# Altium project Phaser.PrjPCB (part 2 of 9)

## Sheet PWR_Supply.SchDoc: Phaser
size 420 x 297 mm; EDA_Number: ARTIQ; Projet: ARTIQ/SINARA; Author: G.Kasprowicz; CompanyName: WUT ISE; DrawnBy: G.Kasprowicz; Organization: WUT ISE; Address1: PW ISE; Address2: Nowowiejska 15/19 00-665 Warsaw; Address3: gkasprow@gmail.com; DocumentNumber: 16; Revision: 2; SheetNumber: 16; SheetTotal: 18; ModifiedBy: -; CheckedDate: -; Title2: AFE PWR, testpoints, LEDs; DivGrp: WUT ISE; Designer: G.Kasprowicz; ModifiedDate: -; ProjectName: Sensor Box
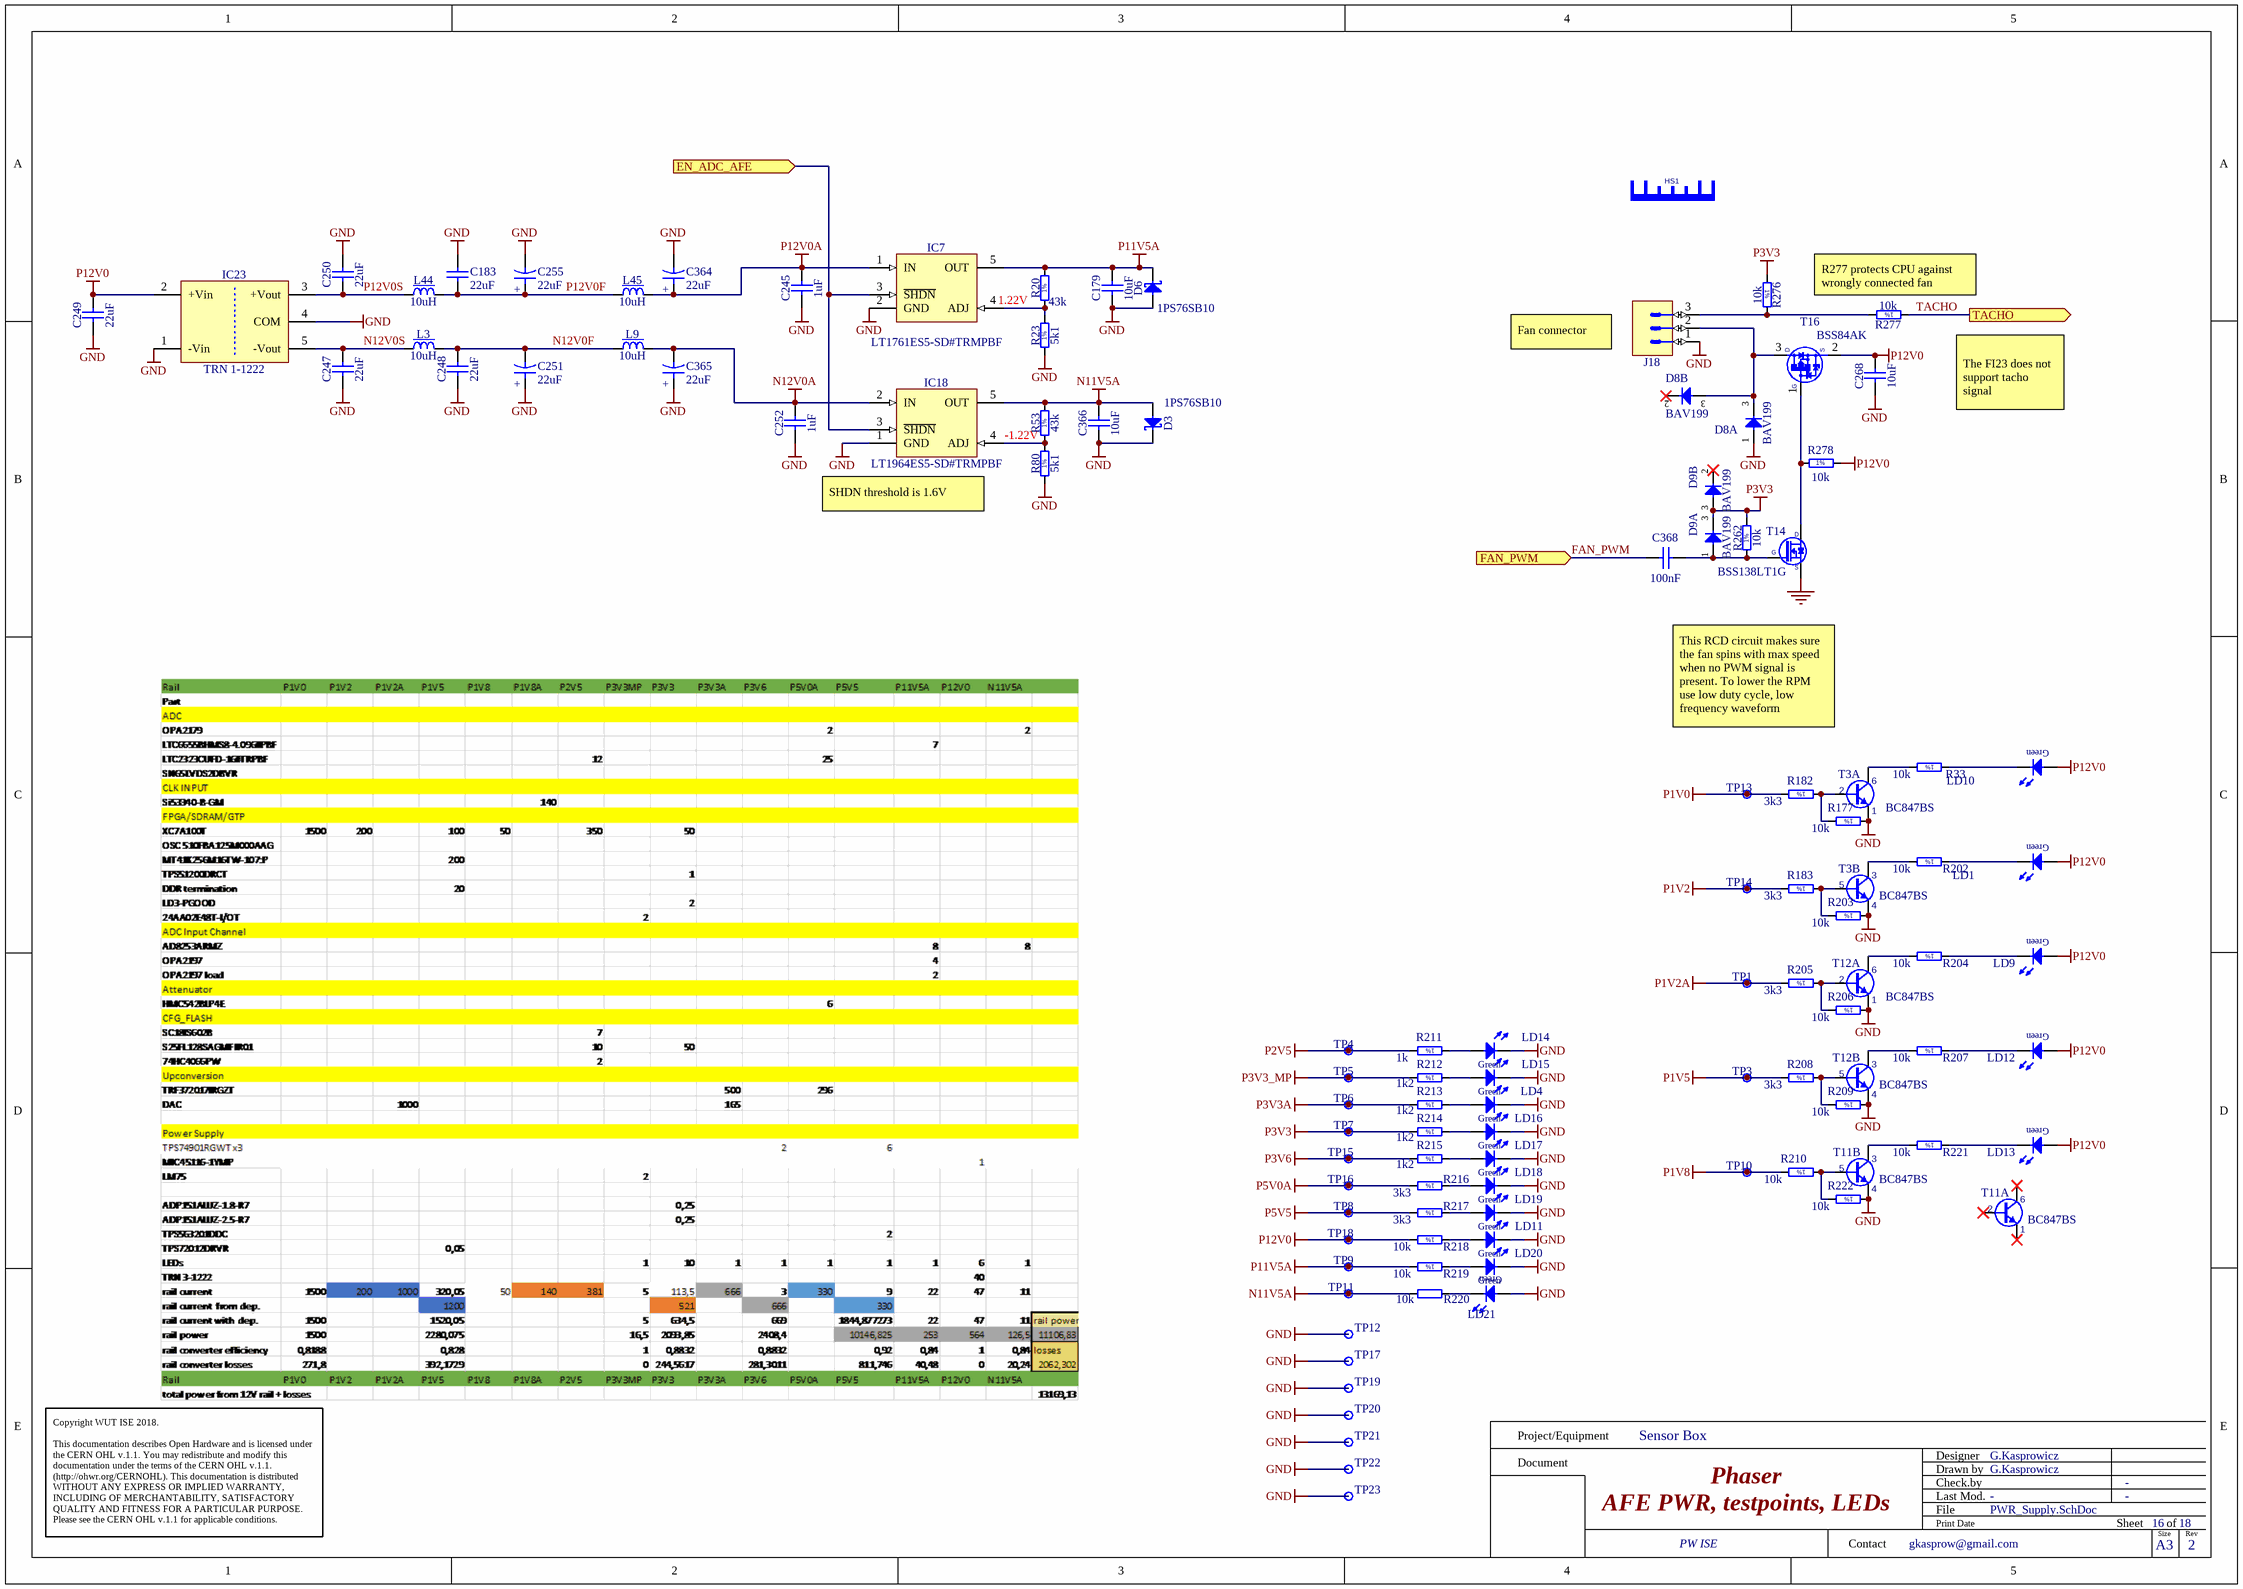
[diagram p3: PWR_Supply.SchDoc]

### Parts
C179  10uF  [CAPC2012X135N]
C183  22uF  [CAPC2012X135N]
C245  1uF  [CAPC1608X87N]
C247  22uF  [CAPC2012X135N]
C248  22uF  [CAPC2012X135N]
C249  22uF  [CAPC2012X135N]
C250  22uF  [CAPC2012X135N]
C251  22uF  [CAPMP3528X210N]
C252  1uF  [CAPC1608X87N]
C255  22uF  [CAPMP3528X210N]
C268  10uF  [CAPC2012X135N]
C364  22uF  [CAPMP3528X210N]
C365  22uF  [CAPMP3528X210N]
C366  10uF  [CAPC2012X135N]
C368  100nF  [CAPC0603X33N]
D3  1PS76SB10  [SOD2512X110N]
D6  1PS76SB10  [SOD2512X110N]
D8  BAV199  [SOT95P240X110-3N]  (parts A,B of 2)
D9  BAV199  [SOT95P240X110-3N]  (parts A,B of 2)
HS1  RADIAN_FI23  [RADIAN_FI23]  (value not drawn)
IC7  LT1761ES5-SD#TRMPBF  [SOT95P280X100-5N]
IC18  LT1964ES5-SD#TRMPBF  [SOT95P280X100-5N]
IC23  TRN 1-1222  [DCDC_TRACO_TRN1]
J18  KK®  [MOLEX_22-27-2031]  (value not drawn)
L3  10uH  [IND_MURATA-PS_8400]
L9  10uH  [IND_MURATA-PS_8400]
L44  10uH  [IND_MURATA-PS_8400]
L45  10uH  [IND_MURATA-PS_8400]
LD1  Green  [LED_KINGBRIGHT_KPH-1608CGCKr]  (value not drawn)
LD4  Green  [LED_KINGBRIGHT_KPH-1608CGCKr]  (value not drawn)
LD9  Green  [LED_KINGBRIGHT_KPH-1608CGCKr]  (value not drawn)
LD10  Green  [LED_KINGBRIGHT_KPH-1608CGCKr]  (value not drawn)
LD11  Green  [LED_KINGBRIGHT_KPH-1608CGCKr]  (value not drawn)
LD12  Green  [LED_KINGBRIGHT_KPH-1608CGCKr]  (value not drawn)
LD13  Green  [LED_KINGBRIGHT_KPH-1608CGCKr]  (value not drawn)
LD14  Green  [LED_KINGBRIGHT_KPH-1608CGCKr]  (value not drawn)
LD15  Green  [LED_KINGBRIGHT_KPH-1608CGCKr]  (value not drawn)
LD16  Green  [LED_KINGBRIGHT_KPH-1608CGCKr]  (value not drawn)
LD17  Green  [LED_KINGBRIGHT_KPH-1608CGCKr]  (value not drawn)
LD18  Green  [LED_KINGBRIGHT_KPH-1608CGCKr]  (value not drawn)
LD19  Green  [LED_KINGBRIGHT_KPH-1608CGCKr]  (value not drawn)
LD20  Green  [LED_KINGBRIGHT_KPH-1608CGCKr]  (value not drawn)
LD21  Green  [LED_KINGBRIGHT_KPH-1608CGCKr]  (value not drawn)
R20  43k  [RESC1005X40N]
R23  5k1  [RESC1005X40N]
R33  10k  [RESC1005X40N]
R53  43k  [RESC1005X40N]
R80  5k1  [RESC1005X40N]
R177  10k  [RESC1005X40N]
R182  3k3  [RESC1608X55N]
R183  3k3  [RESC1608X55N]
R202  10k  [RESC1005X40N]
R203  10k  [RESC1005X40N]
R204  10k  [RESC1005X40N]
R205  3k3  [RESC1608X55N]
R206  10k  [RESC1005X40N]
R207  10k  [RESC1005X40N]
R208  3k3  [RESC1608X55N]
R209  10k  [RESC1005X40N]
R210  10k  [RESC1005X40N]
R211  1k  [RESC1608X55N]
R212  1k2  [RESC1608X55N]
R213  1k2  [RESC1608X55N]
R214  1k2  [RESC1608X55N]
R215  1k2  [RESC1608X55N]
R216  3k3  [RESC1608X55N]
R217  3k3  [RESC1608X55N]
R218  10k  [RESC1005X40N]
R219  10k  [RESC1005X40N]
R220  10k  [RESC1608X55N]
R221  10k  [RESC1005X40N]
R222  10k  [RESC1005X40N]
R262  10k  [RESC1005X40N]
R276  10k  [RESC1005X40N]
R277  10k  [RESC1005X40N]
R278  10k  [RESC1005X40N]
T3  BC847BS  [SOT65P210X110-6N]  (parts A,B of 2)
T11  BC847BS  [SOT65P210X110-6N]  (parts A,B of 2)
T12  BC847BS  [SOT65P210X110-6N]  (parts A,B of 2)
T14  BSS138LT1G  [SOT95P240X110-3N]
T16  BSS84AK  [SOT95P230X110-3N]
TP1  Test Point  [TPS127]  (value not drawn)
TP3  Test Point  [TPS127]  (value not drawn)
TP4  Test Point  [TPS127]  (value not drawn)
TP5  Test Point  [TPS127]  (value not drawn)
TP6  Test Point  [TPS127]  (value not drawn)
TP7  Test Point  [TPS127]  (value not drawn)
TP8  Test Point  [TPS127]  (value not drawn)
TP9  Test Point  [TPS127]  (value not drawn)
TP10  Test Point  [TPS127]  (value not drawn)
TP11  Test Point  [TPS127]  (value not drawn)
TP12  Test Point  [TPS127]  (value not drawn)
TP13  Test Point  [TPS127]  (value not drawn)
TP14  Test Point  [TPS127]  (value not drawn)
TP15  Test Point  [TPS127]  (value not drawn)
TP16  Test Point  [TPS127]  (value not drawn)
TP17  Test Point  [TPS127]  (value not drawn)
TP18  Test Point  [TPS127]  (value not drawn)
TP19  Test Point  [TPS127]  (value not drawn)
TP20  Test Point  [TPS127]  (value not drawn)
TP21  Test Point  [TPS127]  (value not drawn)
TP22  Test Point  [TPS127]  (value not drawn)
TP23  Test Point  [TPS127]  (value not drawn)

### Ports
EN_ADC_AFE (in), FAN_PWM (in), TACHO (out)

### Nets
GND: C179.1 C183.1 C245.1 C247.1 C248.1 C249.1 C250.2 C251.1 C252.1 C255.2 C268.1 C364.2 C365.1 C366.1 D3.1(C) D6.2(A) D8.1(A) IC7.2(GND) IC18.1(GND) IC23.1(-Vin) IC23.4(COM) J18.1 LD4.1(C) LD11.1(C) LD14.1(C) LD15.1(C) LD16.1(C) LD17.1(C) LD18.1(C) LD19.1(C) LD20.1(C) LD21.2(A) R23.1 R80.1 R177.1 R203.1 R206.1 R209.1 R222.1 T3.1(E) T3.4(E) T11.4(E) T12.1(E) T12.4(E) T14.2(S) TP12.1 TP17.1 TP19.1 TP20.1 TP21.1 TP22.1 TP23.1
N11V5A: C366.2 D3.2(A) IC18.5(OUT) R53.2 R220.2 TP11.1
N12V0A: C252.2 C365.2 IC18.2(IN) L9.2
P1V0: R182.2 TP13.1
P1V2: R183.2 TP14.1
P1V2A: R205.2 TP1.1
P1V5: R208.2 TP3.1
P1V8: R210.2 TP10.1
P2V5: R211.2 TP4.1
P3V3: D9.3(COMAC) R214.2 R262.2 R276.1 TP7.1
P3V3_MP: R212.2 TP5.1
P3V3A: R213.2 TP6.1
P3V6: R215.2 TP15.1
P5V0A: R216.2 TP16.1
P5V5: R217.2 TP8.1
P11V5A: C179.2 D6.1(C) IC7.5(OUT) R20.2 R219.2 TP9.1
P12V0: C249.2 C268.2 IC23.2(+Vin) LD1.2(A) LD9.2(A) LD10.2(A) LD12.2(A) LD13.2(A) R218.2 R278.2 T16.2(S) TP18.1
P12V0A: C245.2 C364.1 IC7.1(IN) L45.2
FAN_PWM: C368.2 ; port FAN_PWM
N12V0F: C248.2 C251.2 L3.2 L9.1
N12V0S: C247.2 IC23.5(-Vout) L3.1
P12V0F: C183.2 C255.1 L44.2 L45.1
P12V0S: C250.1 IC23.3(+Vout) L44.1
TACHO: R277.1 ; port TACHO  [project net FAN_TACHO]
NetC368_1: C368.1 D9.1(A) R262.1 T14.1(G)
NetD8_3: D8.3(COMAC) J18.2 T16.3(D)
NetIC7_3: IC7.3(~{SHDN}) IC18.3(~{SHDN}) ; port EN_ADC_AFE
NetIC7_4: IC7.4(ADJ) R20.1 R23.2
NetIC18_4: IC18.4(ADJ) R53.1 R80.2
NetJ18_3: J18.3 R276.2 R277.2
NetLD1_1: LD1.1(C) R202.1
NetLD4_2: LD4.2(A) R213.1
NetLD9_1: LD9.1(C) R204.1
NetLD10_1: LD10.1(C) R33.1
NetLD11_2: LD11.2(A) R218.1
NetLD12_1: LD12.1(C) R207.1
NetLD13_1: LD13.1(C) R221.1
NetLD14_2: LD14.2(A) R211.1
NetLD15_2: LD15.2(A) R212.1
NetLD16_2: LD16.2(A) R214.1
NetLD17_2: LD17.2(A) R215.1
NetLD18_2: LD18.2(A) R216.1
NetLD19_2: LD19.2(A) R217.1
NetLD20_2: LD20.2(A) R219.1
NetLD21_1: LD21.1(C) R220.1
NetR33_2: R33.2 T3.6(C)
NetR177_2: R177.2 R182.1 T3.2(B)
NetR183_1: R183.1 R203.2 T3.5(B)
NetR202_2: R202.2 T3.3(C)
NetR204_2: R204.2 T12.6(C)
NetR205_1: R205.1 R206.2 T12.2(B)
NetR207_2: R207.2 T12.3(C)
NetR208_1: R208.1 R209.2 T12.5(B)
NetR210_1: R210.1 R222.2 T11.5(B)
NetR221_2: R221.2 T11.3(C)
NetR278_1: R278.1 T14.3(D) T16.1(G)

Not connected (* = marked no-connect by the designer): D8 2(C)*; D9 2(C)*; T11 1(E)* 2(B)* 6(C)*

### Notes on the sheet
- 1.22V
- (near R277) R277 protects CPU against wrongly connected fan
- Fan connector
- -1.22V
- The FI23 does not support tacho signal
- SHDN threshold is 1.6V
- This RCD circuit makes sure the fan spins with max speed when no PWM signal is present. To lower the RPM use low duty cycle, low frequency waveform
- Project/Equipment
- Document
- Designer
- Drawn by
- Check.by
- Copyright WUT ISE 2018.
  This documentation describes Open Hardware and is licensed under the CERN OHL v.1.1. You may redistribute and modify this documentation under the terms of the CERN OHL v.1.1. (http://ohwr.org/CERNOHL). This documentation is distributed WITHOUT ANY EXPRESS OR IMPLIED WARRANTY, INCLUDING OF MERCHANTABILITY, SATISFACTORY QUALITY AND FITNESS FOR A PARTICULAR PURPOSE. Please see the CERN OHL v.1.1 for applicable conditions.
- Contact
- File
- Last Mod.
- Print Date
- Sheet
- Size
- A3
- of
- Rev
- (in symbol CTE3528-21_22UF_10V_10%_LESR0700) +
- (in symbol R0402_5K1_1%_0.0625W_100PPM) 1%
- (in symbol R0402_10K_1%_0.0625W_100PPM) 1%
- (in symbol R0402_10k_1%_0.0625W_100PPM) 1%
- (in symbol R0402_43K_1%_0.0625W_100PPM) 1%
- (in symbol R0603_1K2_1%_0.1W_100PPM) 1%
- (in symbol R0603_1K_1%_0.1W_100PPM) 1%
- (in symbol R0603_3k3_1%_0.1W_100PPM) 1%

### Library data of the parts
C179 C268 C366 = CC0805_10UF_16V_10%_X5R: Non-polarised capacitor; Part Description: SMD Multilayer Chip Ceramic Capacitor; Manufacturer: GENERIC; Manufacturer1 Part Number: C0805C106K4PAC; Voltage: 16V; TC: X5R; Tolerance: ±10%; Part Number: CC0805_10UF_16V_10%_X5R; Component Kind: Standard; Component Type: Standard; Pin Count: 2; Value: 10uF; Status: Preferred; Manufacturer Part Number: CC0805_10UF_16V_10%_X5R; Case: 0805; Mounted: Yes; Socket: No; SMD: Yes; Manufacturer1 Example: KEMET; Manufacturer1 ComponentHeight: 1.4mm; HelpURL: \\cern.ch\dfs\Applications\Altium\Datasheets\CC1206_X5R_KEMET.pdf; Author: CERN DEM JLC; CreateDate: 03.12.2007; LatestRevisionDate: 03.12.2007; Sense: No
C183 C247-C250 = CC0805_22UF_16V_10%_X5R: Non-polarised capacitor; Part Description: SMD Multilayer Chip Ceramic Capacitor; Manufacturer: GENERIC; Manufacturer1 Part Number: C2012X5R1C226KT; Voltage: 16V; TC: X5R; Tolerance: ±10%; Part Number: CC0805_22UF_16V_10%_X5R; Component Kind: Standard; Component Type: Standard; Pin Count: 2; Value: 22uF; Status: Preferred; Manufacturer Part Number: CC0805_22UF_16V_10%_X5R; Case: 0805; Mounted: Yes; Socket: No; SMD: Yes; Sense: No; Manufacturer1 Example: TDK; Manufacturer1 ComponentHeight: 1.35mm; HelpURL: \\cern.ch\dfs\Applications\Altium\Datasheets\CC0805_X5R_TDK_C.pdf; Author: CERN DEM JLC; CreateDate: 25.10.2012; LatestRevisionDate: 25.10.2012
C245 C252 = CC0603_1UF_25V_10%_X7R: Non-polarised capacitor; Part Description: SMD Multilayer Chip Ceramic Capacitor; Manufacturer: GENERIC; Manufacturer1 Part Number: GRM188R71E105KA12D; Voltage: 25V; TC: X7R; Tolerance: ±10%; Part Number: CC0603_1UF_25V_10%_X7R; Component Kind: Standard; Component Type: Standard; Pin Count: 2; Value: 1uF; Status: None; Manufacturer Part Number: CC0603_1UF_25V_10%_X7R; Case: 0603; Mounted: Yes; Socket: No; SMD: Yes; Sense: No; Manufacturer1 Example: MURATA; Manufacturer1 ComponentHeight: 0.9mm; HelpURL: \\cern.ch\dfs\Applications\Altium\Datasheets\CC0603_X7R_MURATA.pdf; Author: CERN DEM JLC; CreateDate: 18.01.2011; LatestRevisionDate: 18.01.2011
C251 C255 C364 C365 = CTE3528-21_22UF_10V_10%_LESR0700: Polarised capacitor; Part Description: Low ESR 0R7 Solid Tantalum Chip Capacitor; Manufacturer: GENERIC; Manufacturer1 Part Number: TPSB226K010R0700; Voltage: 10V; Tolerance: ±10%; Part Number: CTE3528-21_22UF_10V_10%_LESR0700; Component Kind: Standard; Component Type: Standard; Pin Count: 2; Value: 22uF; Status: Preferred; Manufacturer Part Number: CTE3528-21_22UF_10V_10%_LESR0700; Case: B; Mounted: Yes; Socket: No; SMD: Yes; Sense: No; Manufacturer1 Example: AVX; Manufacturer1 ComponentHeight: 2.1mm; HelpURL: \\cern.ch\dfs\Applications\Altium\Datasheets\CTE-LESR_AVX_TPS.pdf; Author: CERN DEM JLC; CreateDate: 05.05.2008; LatestRevisionDate: 20.01.2009
C368 = CC0201_100NF_6.3V_10%_X5R: Non-polarised capacitor; Part Description: SMD Multilayer Chip Ceramic Capacitor; Manufacturer: GENERIC; Manufacturer1 Part Number: 02016D104KAT2A; Voltage: 6.3V; TC: X5R; Tolerance: ±10%; Part Number: CC0201_100NF_6.3V_10%_X5R; Component Kind: Standard; Component Type: Standard; Pin Count: 2; Value: 100nF; Status: Not Recommended; Manufacturer Part Number: CC0201_100NF_6.3V_10%_X5R; Case: 0201; Mounted: Yes; Socket: No; SMD: Yes; Sense: No; Manufacturer1 Example: AVX; Manufacturer1 ComponentHeight: 0.33mm; HelpURL: \\cern.ch\dfs\Applications\Altium\Datasheets\CC0201_X5R_AVX.pdf; Author: CERN DEM JLC; CreateDate: 2007-12-03; LatestRevisionDate: 2007-12-03; ClassName: FPGA_JTAG
D3 D6 = 1PS76SB10: Schottky Diode; Part Description: Schottky Barrier Single Diode; Manufacturer: NXP SEMICONDUCTORS; Voltage: 30V; Power: 200mA; PressFit: No; Bonding: No; Part Number: 1PS76SB10; Component Kind: Standard; Component Type: Standard; Device: 1PS76SB10; PackageDescription: Small Outline Diode Flat Lead (SOD-323), 1.70mm W X 1.25mm L X 1.10mm H body,  IPC Medium Density; Manufacturer Part Number: 1PS76SB10; Pin Count: 2; Case: SOD323; Mounted: Yes; Socket: No; SMD: Yes; Sense: No; ComponentHeight: 1.1mm; HelpURL: \\cern.ch\dfs\Applications\Altium\Datasheets\1PS76SB10.pdf; Author: CERN DEM JLC; CreateDate: 2012-12-06; LatestRevisionDate: 2012-12-06
D8 D9 = BAV199: Serial Diode; Part Description: Low-Leakage Double Diode; Manufacturer: NXP SEMICONDUCTORS; Voltage: 75V; Power: 250mW; PressFit: No; Bonding: No; Part Number: BAV199; Component Kind: Standard; Component Type: Standard; Device: BAV199; PackageDescription: SOT23 3-Leads, Pitch 0.95mm - Body 1.4x3mm, IPC Medium Density; Manufacturer Part Number: BAV199; Pin Count: 3; Case: SOT23-3; Mounted: Yes; Socket: No; SMD: Yes; Sense: No; ComponentHeight: 1.1mm; HelpURL: \\cern.ch\dfs\Applications\Altium\Datasheets\BAV199.pdf; Author: CERN DEM JMW; CreateDate: 2008-11-21; LatestRevisionDate: 2008-11-21
HS1 = RADIAN_FI23: Heat Sink Without Pad; Manufacturer: Radian Thermal Products, Inc.; Manufacturer Part Number: FI23+BU+T725; Part Description: 23 x 23 x 16 mm, clip on heatsink with fan for IC design BGA and others; ComponentHeight: 16 mm; HelpURL: https://www.radianheatsinks.com/product/fi23/
IC7 = LT1761ES5-SD#TRMPBF: 100mA, Low Noise, LDO Micropower Adjustable Regulator in SOT-23; Part Description: 1.22V to 20V, 100mA, Low Noise, LDO Adjustable Micropower Regulator; Manufacturer: LINEAR TECHNOLOGY; PressFit: No; Bonding: No; Part Number: LT1761ES5-SD#TRMPBF; Component Kind: Standard; Component Type: Standard; Device: LT1761ES5-SD#TRMPBF; PackageDescription: SOT23, 0.95mm pitch; 5 pin, 1.6mm W X 2.9mm L, IPC Medium Density; Manufacturer Part Number: LT1761ES5-SD#TRMPBF; Pin Count: 5; Case: SOT23; Mounted: Yes; Socket: No; SMD: Yes; Sense: No; ComponentHeight: 1mm; HelpURL: \\cern.ch\dfs\Applications\Altium\Datasheets\LT1761ES5-SD#TRMPBF.pdf; Author: CERN DEM JLC; CreateDate: 26.08.2013; LatestRevisionDate: 26.08.2013
IC18 = LT1964ES5-SD#TRMPBF: 200mA, Low Noise, Low Dropout Negative Micropower Regulator; Part Description: -1.22V to -20V, 200mA, Low Noise, Low Dropout Negative Micropower Regulator; Manufacturer: LINEAR TECHNOLOGY; PressFit: No; Bonding: No; Part Number: LT1964ES5-SD#TRMPBF; Component Kind: Standard; Component Type: Standard; Device: LT1964ES5-SD#TRMPBF; PackageDescription: SOT23, 0.95mm pitch; 5 pin, 1.75mm W X 3.00mm L, IPC Medium Density; Manufacturer Part Number: LT1964ES5-SD#TRMPBF; Pin Count: 5; Case: SOT23-5; Mounted: Yes; Socket: No; SMD: Yes; Sense: No; ComponentHeight: 1mm; HelpURL: \\cern.ch\dfs\Applications\Altium\Datasheets\LT1964ES5-SD#TRMPBF.pdf; Author: CERN DEM JLC; CreateDate: 05.05.2009; LatestRevisionDate: 05.05.2009
IC23 = DCDC_TRACO_TRN 1-1222: 9-18VDC to ±12V, Iout (max) ±45mA, 1W DC-DC Converter; Manufacturer: TRACO POWER; PressFit: No; Bonding: No; Part Number: TRN 1-1222; Component Kind: Standard; Component Type: Standard; Device: TRN 1-1222; PackageDescription: TRN 1 Series , Body 11.9 x 7.7mm; Part Description: 9-18VDC to ±12V, Iout (max) ±45mA, 1W DC-DC Converter; Manufacturer Part Number: TRN 1-1222; Pin Count: 5; Mounted: Yes; Socket: No; SMD: No; Sense: No; ComponentHeight: 11.5mm; HelpURL: \\cern.ch\dfs\Applications\Altium\Datasheets\TRN 1-2422.pdf; Author: GK; CreateDate: 06.06.2017; LatestRevisionDate: 06.06.2017
J18 = MOLEX_22-27-2031: Connector 3 Male; Part Description: 2.54mm (.100") Pitch KK® Wire-to-Board Header, Vertical, with Friction Lock, 3 Circuits, Tin (Sn) Plating; Manufacturer: MOLEX; PressFit: No; Part Number: MOLEX_22-27-2031; Component Kind: Standard; Component Type: Standard; Pin Count: 3; Family: KK®; Mounted: Yes; Socket: No; SMD: No; Sense: No; Status: None; Manufacturer Part Number: 22-27-2031; ComponentHeight: 11.7mm; HelpURL: \\cern.ch\dfs\Applications\Altium\Datasheets\MOLEX_22-27-2031.pdf; Author: CERN DEM JLC; CreateDate: 04.12.2008; LatestRevisionDate: 04.12.2008
L3 L9 L44 L45 = IND_10UH_10%_MURATA-PS_8400: Inductor With Core; Part Description: Miniature Surface Mount Power Inductor (8400 Serie); Manufacturer: MURATA POWER SOLUTIONS; Manufacturer Part Number: 84103C; Power: 950mA; Resistance: 0.24R; Tolerance: ±10%; Part Number: IND_10UH_10%_MURATA-PS_8400; Component Kind: Standard; Component Type: Standard; Pin Count: 2; Value: 10uH; Status: None; Mounted: Yes; Socket: No; SMD: Yes; Sense: No; ComponentHeight: 2.9mm; HelpURL: \\cern.ch\dfs\Applications\Altium\Datasheets\IND_MURATA-PS_8400.pdf; Author: CERN DEM JLC; CreateDate: 02.07.2012; LatestRevisionDate: 02.07.2012
LD1 LD4 LD9-LD21 = LED_0603_Green: Green 0603; Part Number: LED_KINGBRIGHT_KPH-1608CGCK; Part Description: SMD Green LED, Case 1.6mmX0.8mm(0603), 0.65mm Thickness; Manufacturer: KINGBRIGHT; Manufacturer Part Number: KPH-1608CGCK; PressFit: No; Bonding: No; Component Kind: Standard; Component Type: Standard; Color: Green; Footprint: LED_KINGBRIGHT_KPH-1608CGCK; PackageDescription: SMT Green LED, Case 0603, Body L 1.6 x W 0.8mm H 0.65mm; Pin Count: 2; Mounted: Yes; Socket: No; SMD: Yes; Sense: No; ComponentHeight: 0.65mm; HelpURL: \\cern.ch\dfs\Applications\Altium\Datasheets\LED_KINGBRIGHT_KPH-1608CGCK.pdf; Author: CERN DEM JLC; CreateDate: 03.07.2017; LatestRevisionDate: 03.07.2017
R20 R53 = R0402_43K_1%_0.0625W_100PPM: Resistor - 1%; Part Description: General Purpose Thick Film Chip Resistor; Manufacturer: GENERIC; Manufacturer1 Part Number: 232270674303L; TC: ±100ppm/°C; PressFit: No; Part Number: R0402_43K_1%_0.0625W_100PPM; Component Kind: Standard; Component Type: Standard; Pin Count: 2; Value: 43k; Status: Not Recommended; Power: 0.0625W; Tolerance: ±1%; Manufacturer Part Number: R0402_43K_1%_0.0625W_100PPM; Case: 0402; Mounted: Yes; Sense: No; Socket: No; SMD: Yes; Manufacturer1 Example: YAGEO PHYCOMP; Manufacturer1 ComponentHeight: 0.4mm; HelpURL: \\cern.ch\dfs\Applications\Altium\Datasheets\R0402_Phycomp_RC0402.pdf; Author: CERN DEM JLC; CreateDate: 03.12.2007; LatestRevisionDate: 17.10.2012
R23 R80 = R0402_5K1_1%_0.0625W_100PPM: Resistor - 1%; Part Description: General Purpose Thick Film Chip Resistor; Manufacturer: GENERIC; Manufacturer1 Part Number: 232270675102L; TC: ±100ppm/°C; PressFit: No; Part Number: R0402_5K1_1%_0.0625W_100PPM; Component Kind: Standard; Component Type: Standard; Pin Count: 2; Value: 5k1; Status: Not Recommended; Power: 0.0625W; Tolerance: ±1%; Manufacturer Part Number: R0402_5K1_1%_0.0625W_100PPM; Case: 0402; Mounted: Yes; Sense: No; Socket: No; SMD: Yes; Manufacturer1 Example: YAGEO PHYCOMP; Manufacturer1 ComponentHeight: 0.4mm; HelpURL: \\cern.ch\dfs\Applications\Altium\Datasheets\R0402_Phycomp_RC0402.pdf; Author: CERN DEM JLC; CreateDate: 03.12.2007; LatestRevisionDate: 17.10.2012
R33 R177 R202-R204 R206 R207 R209 R210 R218 R219 R221 R222 = R0402_10K_1%_0.0625W_100PPM: as R29 on sheet Phaser; Part Number: R0402_10K_1%_0.0625W_100PPM; Component Kind: Standard; Component Type: Standard; Pin Count: 2; Value: 10k; Status: Not recommended; Power: 0.0625W; Tolerance: ±1%; Manufacturer Part Number: R0402_10K_1%_0.0625W_100PPM; Case: 0402; Mounted: Yes; Sense: No; Socket: No; SMD: Yes; Manufacturer1 Example: YAGEO PHYCOMP; Manufacturer1 ComponentHeight: 0.4mm; HelpURL: \\cern.ch\dfs\Applications\Altium\Datasheets\R0402_Phycomp_RC0402.pdf; Author: CERN DEM JLC; CreateDate: 03.12.2007; LatestRevisionDate: 17.10.2012
R182 R183 R205 R208 R216 R217 = R0603_3k3_1%_0.1W_100PPM: Resistor - 1%; Part Description: General Purpose Thick Film Chip Resistor; Manufacturer: GENERIC; Manufacturer1 Part Number: NRC06F3301TRF; Power: 0.1W; TC: ±100ppm/°C; PressFit: No; Part Number: R0603_3K3_1%_0.1W_100PPM; Component Kind: Standard; Component Type: Standard; Pin Count: 2; Value: 3k3; Status: Preferred; Tolerance: ±1%; Manufacturer Part Number: R0603_3K3_1%_0.1W_100PPM; Case: 0603; Mounted: Yes; Sense: No; Socket: No; SMD: Yes; Manufacturer1 Example: NIC COMPONENT; Manufacturer1 ComponentHeight: 0.55mm; HelpURL: \\cern.ch\dfs\Applications\Altium\Datasheets\R0603_NIC_NRC.pdf; Author: CERN DEM JLC; CreateDate: 03.12.2007; LatestRevisionDate: 13.03.2008
R211 = R0603_1K_1%_0.1W_100PPM: Resistor - 1%; Part Description: General Purpose Thick Film Chip Resistor; Manufacturer: GENERIC; Manufacturer1 Part Number: NRC06F1001TRF; Power: 0.1W; TC: ±100ppm/°C; PressFit: No; Part Number: R0603_1K_1%_0.1W_100PPM; Component Kind: Standard; Component Type: Standard; Pin Count: 2; Value: 1k; Status: Preferred; Tolerance: ±1%; Manufacturer Part Number: R0603_1K_1%_0.1W_100PPM; Case: 0603; Mounted: Yes; Sense: No; Socket: No; SMD: Yes; Manufacturer1 Example: NIC COMPONENT; Manufacturer1 ComponentHeight: 0.55mm; HelpURL: \\cern.ch\dfs\Applications\Altium\Datasheets\R0603_NIC_NRC.pdf; Author: CERN DEM JLC; CreateDate: 03.12.2007; LatestRevisionDate: 13.03.2008
R212-R215 = R0603_1K2_1%_0.1W_100PPM: Resistor - 1%; Part Description: General Purpose Thick Film Chip Resistor; Manufacturer: GENERIC; Manufacturer1 Part Number: NRC06F1201TRF; Power: 0.1W; TC: ±100ppm/°C; Part Number: R0603_1K2_1%_0.1W_100PPM; Component Kind: Standard; Component Type: Standard; Pin Count: 2; Value: 1k2; Status: Preferred; Tolerance: ±1%; Manufacturer Part Number: R0603_1K2_1%_0.1W_100PPM; Case: 0603; Mounted: Yes; Sense: No; Socket: No; SMD: Yes; Manufacturer1 Example: NIC COMPONENT; Manufacturer1 ComponentHeight: 0.55mm; HelpURL: \\cern.ch\dfs\Applications\Altium\Datasheets\R0603_NIC_NRC.pdf; Author: CERN DEM JLC; CreateDate: 03.12.2007; LatestRevisionDate: 13.03.2008
R220 = R0603_10k_1%_0.1W_100PPM: Resistor - 1%; Part Description: General Purpose Thick Film Chip Resistor; Manufacturer: GENERIC; Manufacturer1 Part Number: NRC06F1002TRF; Power: 0.1W; TC: ±100ppm/°C; PressFit: No; Part Number: R0603_10K_1%_0.1W_100PPM; Component Kind: Standard; Component Type: Standard; Pin Count: 2; Value: 10k; Status: Preferred; Tolerance: ±1%; Manufacturer Part Number: R0603_10K_1%_0.1W_100PPM; Case: 0603; Mounted: Yes; Sense: No; Socket: No; SMD: Yes; Manufacturer1 Example: NIC COMPONENT; Manufacturer1 ComponentHeight: 0.55mm; HelpURL: \\cern.ch\dfs\Applications\Altium\Datasheets\R0603_NIC_NRC.pdf; Author: CERN DEM JLC; CreateDate: 03.12.2007; LatestRevisionDate: 13.03.2008
R262 = R0402_10k_1%_0.0625W_100PPM: Resistor - 1%; Part Description: General Purpose Thick Film Chip Resistor; Manufacturer: GENERIC; Manufacturer1 Part Number: 232270671003L; TC: ±100ppm/°C; PressFit: No; Part Number: R0402_10K_1%_0.0625W_100PPM; Component Kind: Standard; Component Type: Standard; Pin Count: 2; Value: 10k; Status: Not Recommended; Power: 0.0625W; Tolerance: ±1%; Manufacturer Part Number: R0402_10K_1%_0.0625W_100PPM; Case: 0402; Mounted: Yes; Sense: No; Socket: No; SMD: Yes; Manufacturer1 Example: YAGEO PHYCOMP; Manufacturer1 ComponentHeight: 0.4mm; HelpURL: \\cern.ch\dfs\Applications\Altium\Datasheets\R0402_Phycomp_RC0402.pdf; Author: CERN DEM JLC; CreateDate: 03.12.2007; LatestRevisionDate: 17.10.2012
R276-R278 = R0402_10K_1%_0.0625W_100PPM: Resistor - 1%; Part Description: General Purpose Thick Film Chip Resistor; Manufacturer: GENERIC; Manufacturer1 Part Number: 232270671003L; TC: ±100ppm/°C; PressFit: No; Part Number: R0402_10K_1%_0.0625W_100PPM; Component Kind: Standard; Component Type: Standard; Pin Count: 2; Value: 10k; Status: Not Recommended; Power: 0.0625W; Tolerance: ±1%; Manufacturer Part Number: R0402_10K_1%_0.0625W_100PPM; Case: 0402; Mounted: Yes; Sense: No; Socket: No; SMD: Yes; Manufacturer1 Example: YAGEO PHYCOMP; Manufacturer1 ComponentHeight: 0.4mm; HelpURL: \\cern.ch\dfs\Applications\Altium\Datasheets\R0402_Phycomp_RC0402.pdf; Author: CERN DEM JLC; CreateDate: 03.12.2007; LatestRevisionDate: 17.10.2012
T3 T11 T12 = BC847BS: 45V 100mA Dual NPN General-Purpose Transistor; Manufacturer: NXP SEMICONDUCTORS; PressFit: No; Bonding: No; Part Number: BC847BS; Component Kind: Standard; Component Type: Standard; Device: BC847BS; PackageDescription: SOT363, SC-88, SOT, 0.65mm Pitch, 6 pin, 1.25mm W X 2.00mm L X 1.10mm H, IPC Medium Density; Part Description: 45V 100mA Dual NPN General-Purpose Transistor; Manufacturer Part Number: BC847BS; Pin Count: 6; Case: SOT363; Mounted: Yes; Socket: No; SMD: Yes; Sense: No; ComponentHeight: 1.1mm; HelpURL: \\cern.ch\dfs\Applications\Altium\Datasheets\BC847BS.pdf; Author: CERN DEM JMW; CreateDate: 10.07.2015; LatestRevisionDate: 10.07.2015
T14 = BSS138LT1G: as T2 on sheet Phaser; Part Number: BSS138LT1G; Component Kind: Standard; Component Type: Standard; Device: BSS138LT1G; PackageDescription: SOT23, 0.95mm Pitch; 3 Pin, 1.40mm W X 3.00mm L X 1.10mm H body, IPC Medium Density; Manufacturer Part Number: BSS138LT1G; Pin Count: 3; Case: SOT23-3; Mounted: Yes; Socket: No; SMD: Yes; Sense: No; ComponentHeight: 1.11mm; HelpURL: \\cern.ch\dfs\Applications\Altium\Datasheets\BSS138LT1G.pdf; Author: CERN DEM JLC; CreateDate: 23.03.2009; LatestRevisionDate: 23.03.2009
T16 = BSS84AK: 50V, 180mA P-Channel Trench MOSFET; Part Description: 50V, 180mA P-channel Trench MOSFET Transistor; Manufacturer: NXP SEMICONDUCTORS; PressFit: No; Bonding: No; Part Number: BSS84AK; Component Kind: Standard; Component Type: Standard; Device: BSS84AK; PackageDescription: SOT23, 0.95mm Pitch; 3 Pin, 1.30mm W X 2.90mm L X 1.10mm H body, IPC Medium Density; Manufacturer Part Number: BSS84AK; Pin Count: 3; Case: SOT23-3; Mounted: Yes; Socket: No; SMD: Yes; Sense: No; ComponentHeight: 1.1mm; HelpURL: \\cern.ch\dfs\Applications\Altium\Datasheets\BSS84AK.pdf; Author: CERN DEM JLC; CreateDate: 16.04.2015; LatestRevisionDate: 16.04.2015
TP1 TP3-TP23 = SMD_PAD_1.27X1.27MM: Part Description: 1.27mm x 1.27mm PCB Copper Area (SMD Test Point); Mounted: No; Part Number: SMD_PAD_1.27X1.27MM; Component Kind: Standard (No BOM); Component Type: Standard (No BOM); Pin Count: 1; Family: Test Point; Socket: No; SMD: Yes; Sense: No; Status: None; ComponentHeight: 0mm; HelpURL: Undefined; Author: CERN DEM JLC; CreateDate: 12.01.2008; LatestRevisionDate: 12.01.2008; PackageDescription: 1.27mm x 1.27mm PCB Copper Area (SMD Test Point)

## Sheet CLK_INPUT.SchDoc: Phaser
size 420 x 297 mm; EDA_Number: ARTIQ; Projet: ARTIQ/SINARA; Author: G.Kasprowicz; CompanyName: WUT ISE; DrawnBy: G.Kasprowicz; Organization: WUT ISE; Address1: PW ISE; Address2: Nowowiejska 15/19 00-665 Warsaw; Address3: gkasprow@gmail.com; DocumentNumber: 5; Revision: 2; SheetNumber: 5; SheetTotal: 18; ModifiedBy: -; CheckedDate: -; Title2: Clock distribution; DivGrp: WUT ISE; Designer: G.Kasprowicz; ModifiedDate: -; ProjectName: Sensor Box
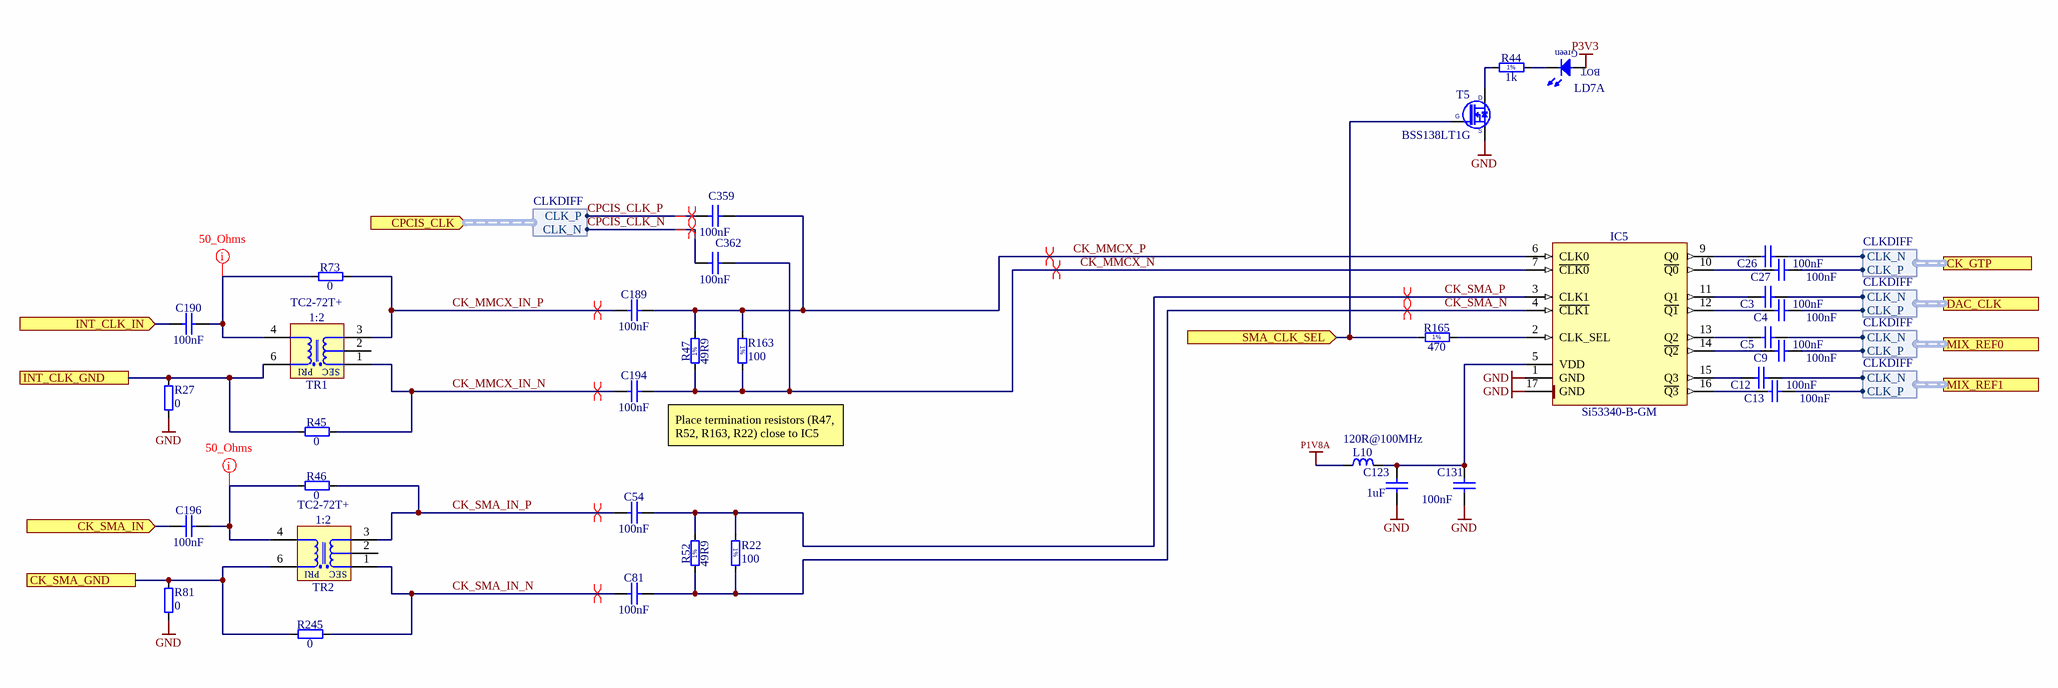
[diagram p4: CLK_INPUT.SchDoc]

### Parts
C3  100nF  [CAPC1005X55N]
C4  100nF  [CAPC1005X55N]
C5  100nF  [CAPC1005X55N]
C9  100nF  [CAPC1005X55N]
C12  100nF  [CAPC1005X55N]
C13  100nF  [CAPC1005X55N]
C26  100nF  [CAPC1005X55N]
C27  100nF  [CAPC1005X55N]
C54  100nF  [CAPC1005X55N]
C81  100nF  [CAPC1005X55N]
C123  1uF  [CAPC1005X55N]
C131  100nF  [CAPC1005X55N]
C189  100nF  [CAPC1005X55N]
C190  100nF  [CAPC1005X55N]
C194  100nF  [CAPC1005X55N]
C196  100nF  [CAPC1005X55N]
C359  100nF  [CAPC1005X55N]
C362  100nF  [CAPC1005X55N]
IC5  Si53340-B-GM  [QFN50P300X300X90-17N-S175]
L10  120R@100MHz  [INDC1608X95N]
LD7  Red/Green  [LED_DIALIGHT_571-0112F]  (value not drawn)  (part A of 2)
R22  100  [RESC1005X40N]
R27  0  [RESC1005X40N]
R44  1k  [RESC1005X40N]
R45  0  [RESC1005X40N]
R46  0  [RESC1005X40N]
R47  49R9  [RESC1005X40N]
R52  49R9  [RESC1005X40N]
R73  0  [RESC1005X40N]
R81  0  [RESC1005X40N]
R163  100  [RESC1005X40N]
R165  470  [RESC1005X40N]
R245  0  [RESC1005X40N]
T5  BSS138LT1G  [SOT95P240X110-3N]
TR1  1:2  Manufacturer Part Number: TC2-72T+  [XFMR_MINI-CIRCUITS_AT1521]
TR2  1:2  Manufacturer Part Number: TC2-72T+  [XFMR_MINI-CIRCUITS_AT1521]

### Ports
CK_GTP (harness CLKDIFF), CK_SMA_GND, CK_SMA_IN (in), CPCIS_CLK (in, harness CLKDIFF), DAC_CLK (harness CLKDIFF), INT_CLK_GND, INT_CLK_IN (in), MIX_REF0 (harness CLKDIFF), MIX_REF1 (harness CLKDIFF), SMA_CLK_SEL (in)

### Harnesses
CLKDIFF: CLK_N, CLK_P

### Nets
GND: C123.1 C131.1 IC5.1(GND) IC5.17(GND) R27.1 R81.1 T5.2(S)
P1V8A: L10.2
P3V3: LD7.2(A)
CK_GTP_N: C26.2 ; port CK_GTP.CLK_N
CK_GTP_P: C27.2 ; port CK_GTP.CLK_P
CK_MMCX_IN_N: C194.1 R45.2 TR1.1(SDOT)
CK_MMCX_IN_P: C189.1 R73.2 TR1.3(S)
CK_MMCX_N: C194.2 C362.2 IC5.7(~{CLK0}) R47.1 R163.2
CK_MMCX_P: C189.2 C359.2 IC5.6(CLK0) R47.2 R163.1
CK_SMA_IN_N: C81.1 R245.2 TR2.1(SDOT)
CK_SMA_IN_P: C54.1 R46.2 TR2.3(S)
CK_SMA_N: C81.2 IC5.4(~{CLK1}) R22.2 R52.1
CK_SMA_P: C54.2 IC5.3(CLK1) R22.1 R52.2
CPCIS_CLK_N: C362.1 ; port CPCIS_CLK.CLK_N
CPCIS_CLK_P: C359.1 ; port CPCIS_CLK.CLK_P
DAC_CLK_N: C3.2 ; port DAC_CLK.CLK_N
DAC_CLK_P: C4.2 ; port DAC_CLK.CLK_P
SG0: R81.2 R245.1 TR2.6(PDOT) ; port CK_SMA_GND
SMA_CLK_SEL: R165.1 T5.1(G) ; port SMA_CLK_SEL
UPC_REF_CLK_N: C12.2 ; port MIX_REF1.CLK_N
UPC_REF_CLK_N: C5.2 ; port MIX_REF0.CLK_N  [a separate net that carries the same name]
UPC_REF_CLK_P: C13.2 ; port MIX_REF1.CLK_P
UPC_REF_CLK_P: C9.2 ; port MIX_REF0.CLK_P  [a separate net that carries the same name]
NetC3_1: C3.1 IC5.11(Q1)
NetC4_1: C4.1 IC5.12(~{Q1})
NetC5_1: C5.1 IC5.13(Q2)
NetC9_1: C9.1 IC5.14(~{Q2})
NetC12_1: C12.1 IC5.15(Q3)
NetC13_1: C13.1 IC5.16(~{Q3})
NetC26_1: C26.1 IC5.9(Q0)
NetC27_1: C27.1 IC5.10(~{Q0})
NetC123_2: C123.2 C131.2 IC5.5(VDD) L10.1
NetC190_1: C190.1 ; port INT_CLK_IN
NetC190_2: C190.2 R73.1 TR1.4(P)
NetC196_1: C196.1 ; port CK_SMA_IN
NetC196_2: C196.2 R46.1 TR2.4(P)
NetIC5_2: IC5.2(CLK_SEL) R165.2
NetJ7_2: R27.2 R45.1 TR1.6(PDOT) ; port INT_CLK_GND
NetLD7_1: LD7.1(C) R44.2
NetR44_1: R44.1 T5.3(D)

Not connected (* = marked no-connect by the designer): TR1 2(NC); TR2 2(NC)

### Layout directives
differential pair: CK_MMCX_IN_N, CK_MMCX_IN_P, CK_MMCX_N, CK_MMCX_P, CK_SMA_IN_N, CK_SMA_IN_P, CK_SMA_N, CK_SMA_P, CPCIS_CLK_N, CPCIS_CLK_P
net class 50_Ohms: NetC190_2, NetC196_2

### Notes on the sheet
- Place termination resistors (R47, R52, R163, R22) close to IC5
- Project/Equipment
- Document
- Designer
- Drawn by
- Check.by
- Copyright WUT ISE 2018.
  This documentation describes Open Hardware and is licensed under the CERN OHL v.1.1. You may redistribute and modify this documentation under the terms of the CERN OHL v.1.1. (http://ohwr.org/CERNOHL). This documentation is distributed WITHOUT ANY EXPRESS OR IMPLIED WARRANTY, INCLUDING OF MERCHANTABILITY, SATISFACTORY QUALITY AND FITNESS FOR A PARTICULAR PURPOSE. Please see the CERN OHL v.1.1 for applicable conditions.
- Contact
- File
- Last Mod.
- Print Date
- Sheet
- Size
- A3
- of
- Rev
- (in symbol LED_DIALIGHT_571-0112F, part A) Green; BOT
- (in symbol R0402_1K_1%_0.0625W_100PPM) 1%
- (in symbol R0402_49R9_1%_0.0625W_100PPM) 1%
- (in symbol R0402_100R_1%_0.0625W_100PPM) 1%
- (in symbol R0402_470R_1%_0.0625W_100PPM) 1%
- (in symbol XFMR_MINI-CIRCUITS_TC2-72T+) PRI; SEC

### Library data of the parts
C3-C5 C9 C12 C13 C26 C27 C54 C81 C131 C189 C190 C194 C196 C359 C362 = CC0402_100NF_16V_10%_X5R: Non-polarised capacitor; Part Description: SMD Multilayer Chip Ceramic Capacitor; Manufacturer: GENERIC; Manufacturer1 Part Number: GRM155R61C104KA88D; Voltage: 16V; TC: X5R; Tolerance: ±10%; Part Number: CC0402_100NF_16V_10%_X5R; Component Kind: Standard; Component Type: Standard; Pin Count: 2; Value: 100nF; Status: None; Manufacturer Part Number: CC0402_100NF_16V_10%_X5R; Case: 0402; Mounted: Yes; Socket: No; SMD: Yes; Sense: No; Manufacturer1 Example: MURATA; Manufacturer1 ComponentHeight: 0.55mm; HelpURL: \\cern.ch\dfs\Applications\Altium\Datasheets\CC0402_X5R_MURATA_GRM.pdf; Author: CERN DEM JLC; CreateDate: 10.12.2013; LatestRevisionDate: 10.12.2013
C123 = CC0402_1UF_16V_10%_X5R: as C14 on sheet Attenuator; Part Number: CC0402_1UF_16V_10%_X5R; Component Kind: Standard; Component Type: Standard; Pin Count: 2; Value: 1uF; Status: Preferred; Manufacturer Part Number: CC0402_1UF_16V_10%_X5R; Case: 0402; Mounted: Yes; Socket: No; SMD: Yes; Sense: No; Manufacturer1 Example: TDK; Manufacturer1 ComponentHeight: 0.55mm; HelpURL: \\cern.ch\dfs\Applications\Altium\Datasheets\CC0402_X5R_TDK_C.pdf; Author: CERN DEM JLC; CreateDate: 2012-10-25; LatestRevisionDate: 2012-10-25
IC5 = Si53340-B-GM: Low-Jitter LVDS Fanout Clock Buffers, 10-Output,  Any-Input, Any-Frequency up to 1250MHz; Manufacturer: SILICON LABS; PressFit: No; Bonding: No; Part Number: Si53340-B-GM; Component Kind: Standard; Component Type: Standard; Device: Si53340-B-GM; PackageDescription: QFN, 0.50mm Pitch, Square; 16 Pin, 3.00mm L X 3.00mm W X 0.90mm H Body (w/thermal tab 1.75mm x 1.75mm), IPC Medium Density; Part Description: Low-Jitter LVDS Fanout Clock Buffers, 10-Output,  Any-Input, Any-Frequency up to 1250MHz; Manufacturer Part Number: Si53340-B-GM; Pin Count: 17; Case: QFN16; Mounted: Yes; Socket: No; SMD: Yes; Sense: No; ComponentHeight: 0.9mm; HelpURL: \\cern.ch\dfs\Applications\Altium\Datasheets\Si53340-B-GM.pdf; Author: CERN DEM MR; CreateDate: 04.09.2017; LatestRevisionDate: 04.09.2017
L10 = IND0603_MURATA_BLM18PG121SN1D: Inductor; Part Description: SMD EMIFIL Chip Ferrite Bead; Manufacturer: MURATA; Power: 2A; Resistance: 0.05R; Part Number: IND0603_MURATA_BLM18PG121SN1D; Component Kind: Standard; Component Type: Standard; Pin Count: 2; Value: 120R@100MHz; Status: None; Manufacturer Part Number: BLM18PG121SN1D; Case: 0603; Mounted: Yes; Socket: No; SMD: Yes; Sense: No; ComponentHeight: 0.95mm; HelpURL: \\cern.ch\dfs\Applications\Altium\Datasheets\IND0603_MURATA_BLM18P.pdf; Author: CERN DEM BC; CreateDate: 2015-07-27; LatestRevisionDate: 2015-07-27
LD7 = LED_DIALIGHT_571-0112F: as LD2 on sheet Phaser; Part Number: LED_DIALIGHT_571-0112F; Component Kind: Standard; Component Type: Standard; Color: Red/Green; PackageDescription: 2x 2mm LED (Top: Red, Bot: Green) PCB Edge Mounting (Without positioning pins) DIALIGHT 571 Serie; Manufacturer: DIALIGHT; Manufacturer Part Number: 571-0112F; Pin Count: 4; Mounted: Yes; Socket: No; SMD: No; Sense: No; ComponentHeight: 8.6mm; HelpURL: \\cern.ch\dfs\Applications\Altium\Datasheets\LED_DIALIGHT_571-0112F.pdf; Author: CERN DEM JLC; CreateDate: 09.11.2009; LatestRevisionDate: 17.03.2010
R22 R163 = R0402_100R_1%_0.0625W_100PPM: Resistor - 1%; Part Description: General Purpose Thick Film Chip Resistor; Manufacturer: GENERIC; Manufacturer1 Part Number: 232270671001L; TC: ±100ppm/°C; PressFit: No; Part Number: R0402_100R_1%_0.0625W_100PPM; Component Kind: Standard; Component Type: Standard; Pin Count: 2; Value: 100; Status: Not Recommended; Power: 0.0625W; Tolerance: ±1%; Manufacturer Part Number: R0402_100R_1%_0.0625W_100PPM; Case: 0402; Mounted: Yes; Sense: No; Socket: No; SMD: Yes; Manufacturer1 Example: YAGEO PHYCOMP; Manufacturer1 ComponentHeight: 0.4mm; HelpURL: \\cern.ch\dfs\Applications\Altium\Datasheets\R0402_Phycomp_RC0402.pdf; Author: CERN DEM JLC; CreateDate: 03.12.2007; LatestRevisionDate: 17.10.2012
R27 R45 R46 R73 R81 R245 = R0402_0R_JUMPER: Resistor; Part Description: 1A (0.05R Max DC Resistance) Zero Ohm Jumper; Manufacturer: GENERIC; Manufacturer1 Part Number: 232270591001L; PressFit: No; Part Number: R0402_0R_JUMPER; Component Kind: Standard; Component Type: Standard; Pin Count: 2; Value: 0; Status: Not Recommended; Manufacturer Part Number: R0402_0R_JUMPER; Case: 0402; Mounted: Yes; Sense: No; Socket: No; SMD: Yes; Manufacturer1 Example: YAGEO PHYCOMP; Manufacturer1 ComponentHeight: 0.4mm; HelpURL: \\cern.ch\dfs\Applications\Altium\Datasheets\R0402_Phycomp_RC0402.pdf; Author: CERN DEM JLC; CreateDate: 03.12.2007; LatestRevisionDate: 17.10.2012
R44 = R0402_1K_1%_0.0625W_100PPM: as R26 on sheet Phaser; Part Number: R0402_1K_1%_0.0625W_100PPM; Component Kind: Standard; Component Type: Standard; Pin Count: 2; Value: 1k; Status: Not Recommended; Power: 0.0625W; Tolerance: ±1%; Manufacturer Part Number: R0402_1K_1%_0.0625W_100PPM; Case: 0402; Mounted: Yes; Sense: No; Socket: No; SMD: Yes; Manufacturer1 Example: YAGEO PHYCOMP; Manufacturer1 ComponentHeight: 0.4mm; HelpURL: \\cern.ch\dfs\Applications\Altium\Datasheets\R0402_Phycomp_RC0402.pdf; Author: CERN DEM JLC; CreateDate: 03.12.2007; LatestRevisionDate: 17.10.2012
R47 R52 = R0402_49R9_1%_0.0625W_100PPM: Resistor - 1%; Part Description: General Purpose Thick Film Chip Resistor; Manufacturer: GENERIC; Manufacturer1 Part Number: 232270674999L or RC0402FR-0749R9L; TC: ±100ppm/°C; PressFit: No; Part Number: R0402_49R9_1%_0.0625W_100PPM; Component Kind: Standard; Component Type: Standard; Pin Count: 2; Value: 49R9; Status: Not Recommended; Power: 0.0625W; Tolerance: ±1%; Manufacturer Part Number: R0402_49R9_1%_0.0625W_100PPM; Case: 0402; Mounted: Yes; Sense: No; Socket: No; SMD: Yes; Manufacturer1 Example: YAGEO PHYCOMP; Manufacturer1 ComponentHeight: 0.4mm; HelpURL: \\cern.ch\dfs\Applications\Altium\Datasheets\R0402_Phycomp_RC0402.pdf; Author: CERN DEM JLC; CreateDate: 24.10.2012; LatestRevisionDate: 24.10.2012
R165 = R0402_470R_1%_0.0625W_100PPM: as R147 on sheet Phaser; Part Number: R0402_470R_1%_0.0625W_100PPM; Component Kind: Standard; Component Type: Standard; Pin Count: 2; Value: 470; Status: Not Recommended; Power: 0.0625W; Tolerance: ±1%; Manufacturer Part Number: R0402_470R_1%_0.0625W_100PPM; Case: 0402; Mounted: Yes; Sense: No; Socket: No; SMD: Yes; Manufacturer1 Example: YAGEO PHYCOMP; Manufacturer1 ComponentHeight: 0.4mm; HelpURL: \\cern.ch\dfs\Applications\Altium\Datasheets\R0402_Phycomp_RC0402.pdf; Author: CERN DEM JLC; CreateDate: 03.12.2007; LatestRevisionDate: 17.10.2012
T5 = BSS138LT1G: as T2 on sheet Phaser; Part Number: BSS138LT1G; Component Kind: Standard; Component Type: Standard; Device: BSS138LT1G; PackageDescription: SOT23 3-Leads, Pitch 0.95mm - Body 1.4x3mm, IPC Medium Density; Manufacturer Part Number: BSS138LT1G; Pin Count: 3; Case: SOT23-3; Mounted: Yes; Socket: No; SMD: Yes; Sense: No; ComponentHeight: 1.11mm; HelpURL: \\cern.ch\dfs\Applications\Altium\Datasheets\BSS138LT1G.pdf; Author: CERN DEM JLC; CreateDate: 23.03.2009; LatestRevisionDate: 23.03.2009
TR1 TR2 = XFMR_MINI-CIRCUITS_TC2-72T+: 50 Ohms 10 to 700 MHzz RF Transformer; Part Description: 50 Ohms 10 to 700MHz RF Transformer; Manufacturer: MINI-CIRCUITS; HelpURL: \\cern.ch\dfs\Applications\Altium\Datasheets\XFMR_MINI-CIRCUITS_TC2-1TX+.pdf; Part Number: XFMR_MINI-CIRCUITS_TC2-72T+; Component Kind: Standard; Component Type: Standard; Pin Count: 5; Value: 1:2; Status: None; Mounted: Yes; Socket: No; Sense: No; SMD: Yes; ComponentHeight: 4.06mm; Author: GK; CreateDate: 18.10.2019; LatestRevisionDate: 18.10.2019